# EAGLE schematic prot_2 (EAGLE 6.6.0)

## Sheet 1 of 3
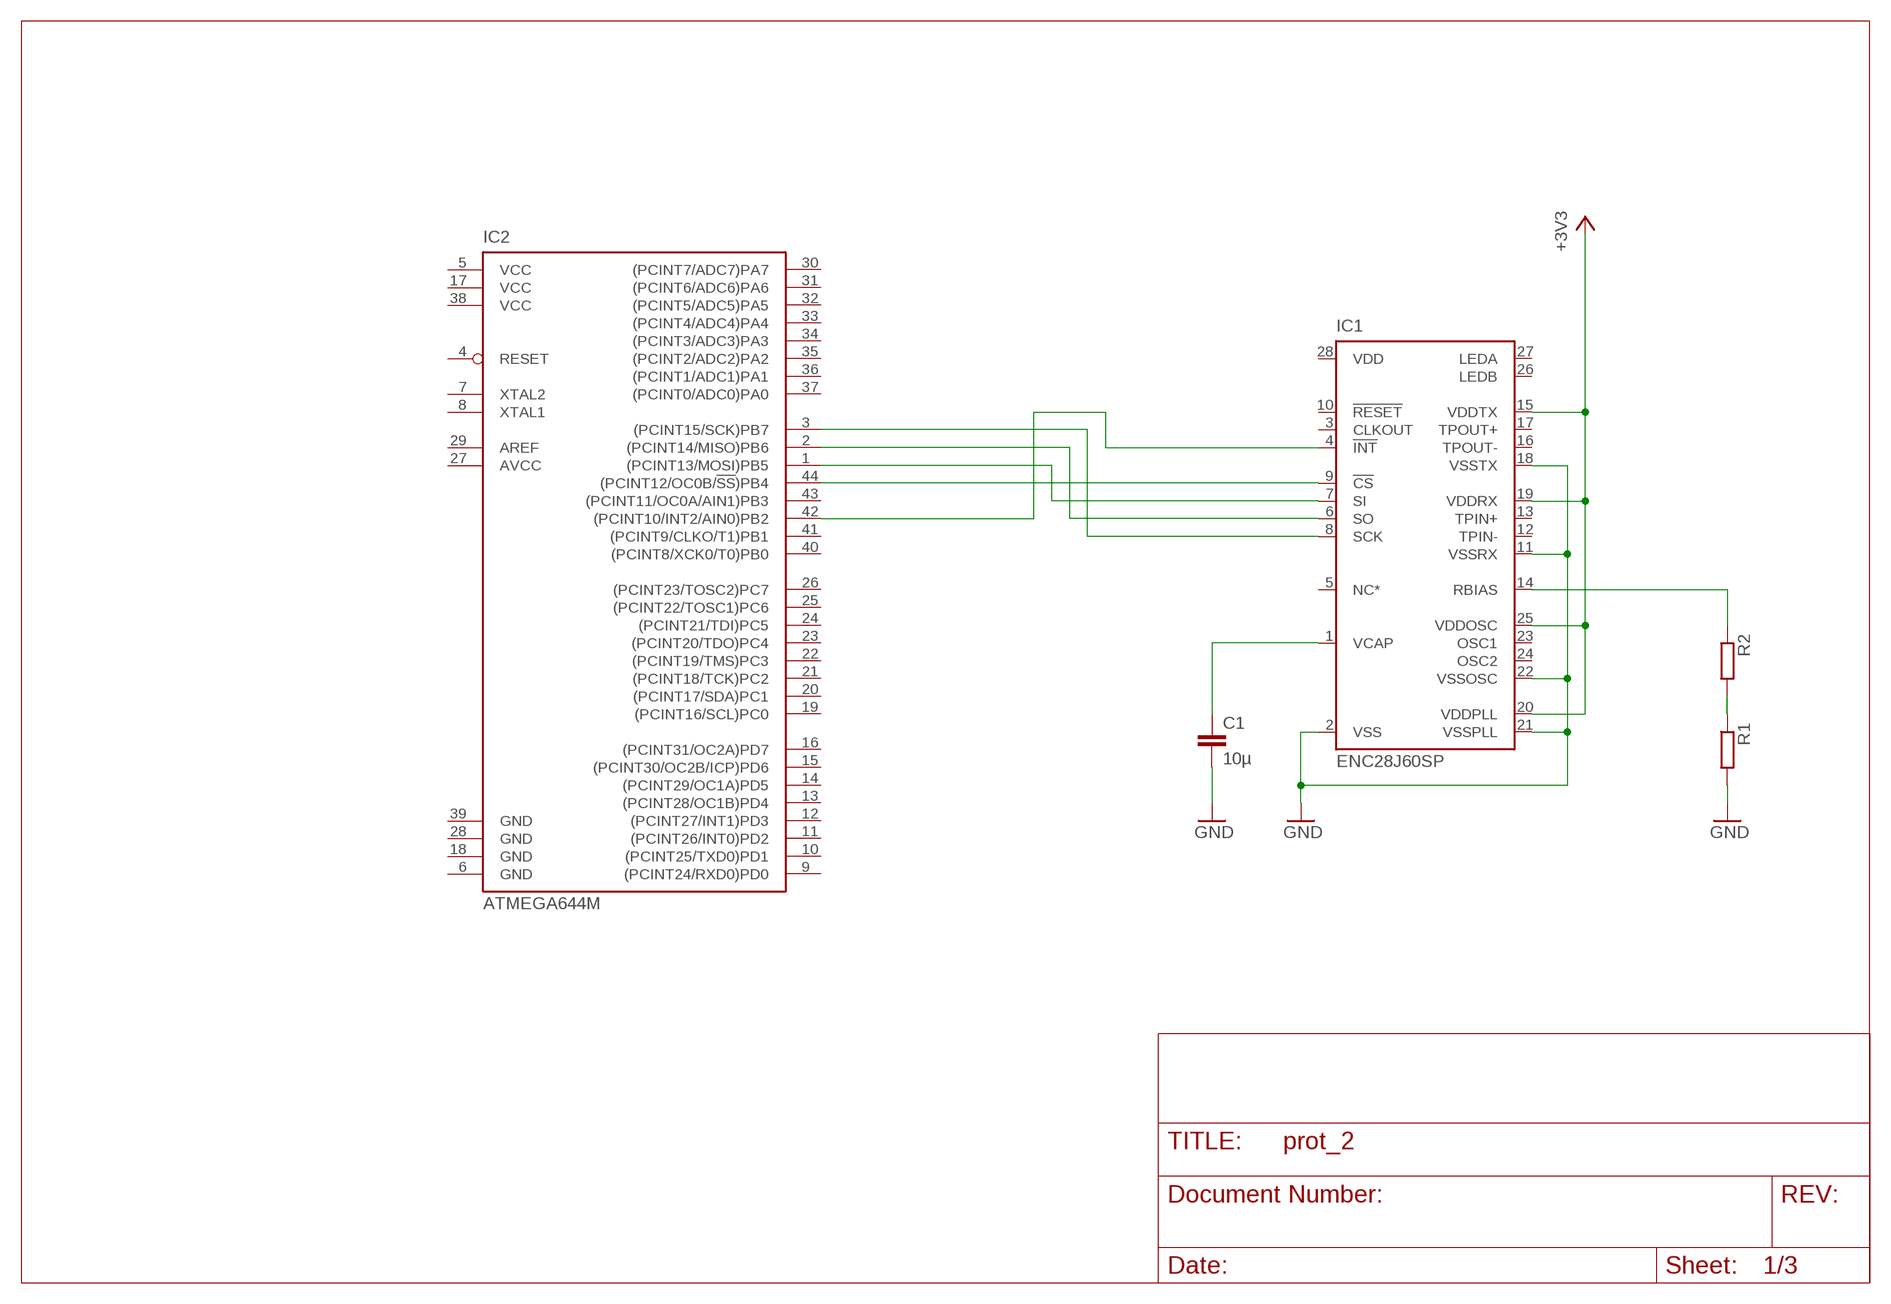
[diagram p0: schematic, sheet 1]

### Parts
C1  10µ  C-EUC1206K  [C1206K]
IC1  ENC28J60SP  [DIL28-3]
IC2  ATMEGA644M  [QFN44ML8X8]
R1  R-EU_R1206  [R1206]
R2  R-EU_R1206  [R1206]

### Nets
+3V3: IC1.15(VDDTX) IC1.19(VDDRX) IC1.20(VDDPLL) IC1.25(VDDOSC) ; also sheet 2,3
GND: C1.2 IC1.2(VSS) IC1.11(VSSRX) IC1.18(VSSTX) IC1.21(VSSPLL) IC1.22(VSSOSC) R1.2 ; also sheet 2,3
N$1: IC1.9(!CS) IC2.44((PCINT12/OC0B/!SS!)PB4)
N$2: IC1.7(SI) IC2.1((PCINT13/MOSI)PB5)
N$3: IC1.6(SO) IC2.2((PCINT14/MISO)PB6)
N$4: IC1.8(SCK) IC2.3((PCINT15/SCK)PB7)
N$5: IC1.4(!INT) IC2.42((PCINT10/INT2/AIN0)PB2)
N$11: C1.1 IC1.1(VCAP)
N$12: R1.1 R2.2
N$13: IC1.14(RBIAS) R2.1
Unconnected: IC1.3(CLKOUT) IC1.5(NC*) IC1.10(!RESET) IC1.12(TPIN-) IC1.13(TPIN+) IC1.16(TPOUT-) IC1.17(TPOUT+) IC1.23(OSC1) IC1.24(OSC2) IC1.26(LEDB) IC1.27(LEDA) IC1.28(VDD) IC2.4(RESET) IC2.7(XTAL2) IC2.8(XTAL1) IC2.9((PCINT24/RXD0)PD0) IC2.10((PCINT25/TXD0)PD1) IC2.11((PCINT26/INT0)PD2) IC2.12((PCINT27/INT1)PD3) IC2.13((PCINT28/OC1B)PD4) IC2.14((PCINT29/OC1A)PD5) IC2.15((PCINT30/OC2B/ICP)PD6) IC2.16((PCINT31/OC2A)PD7) IC2.19((PCINT16/SCL)PC0) IC2.20((PCINT17/SDA)PC1) IC2.21((PCINT18/TCK)PC2) IC2.22((PCINT19/TMS)PC3) IC2.23((PCINT20/TDO)PC4) IC2.24((PCINT21/TDI)PC5) IC2.25((PCINT22/TOSC1)PC6) IC2.26((PCINT23/TOSC2)PC7) IC2.29(AREF) IC2.30((PCINT7/ADC7)PA7) IC2.31((PCINT6/ADC6)PA6) IC2.32((PCINT5/ADC5)PA5) IC2.33((PCINT4/ADC4)PA4) IC2.34((PCINT3/ADC3)PA3) IC2.35((PCINT2/ADC2)PA2) IC2.36((PCINT1/ADC1)PA1) IC2.37((PCINT0/ADC0)PA0) IC2.40((PCINT8/XCK0/T0)PB0) IC2.41((PCINT9/CLKO/T1)PB1) IC2.43((PCINT11/OC0A/AIN1)PB3)

## Sheet 2 of 3
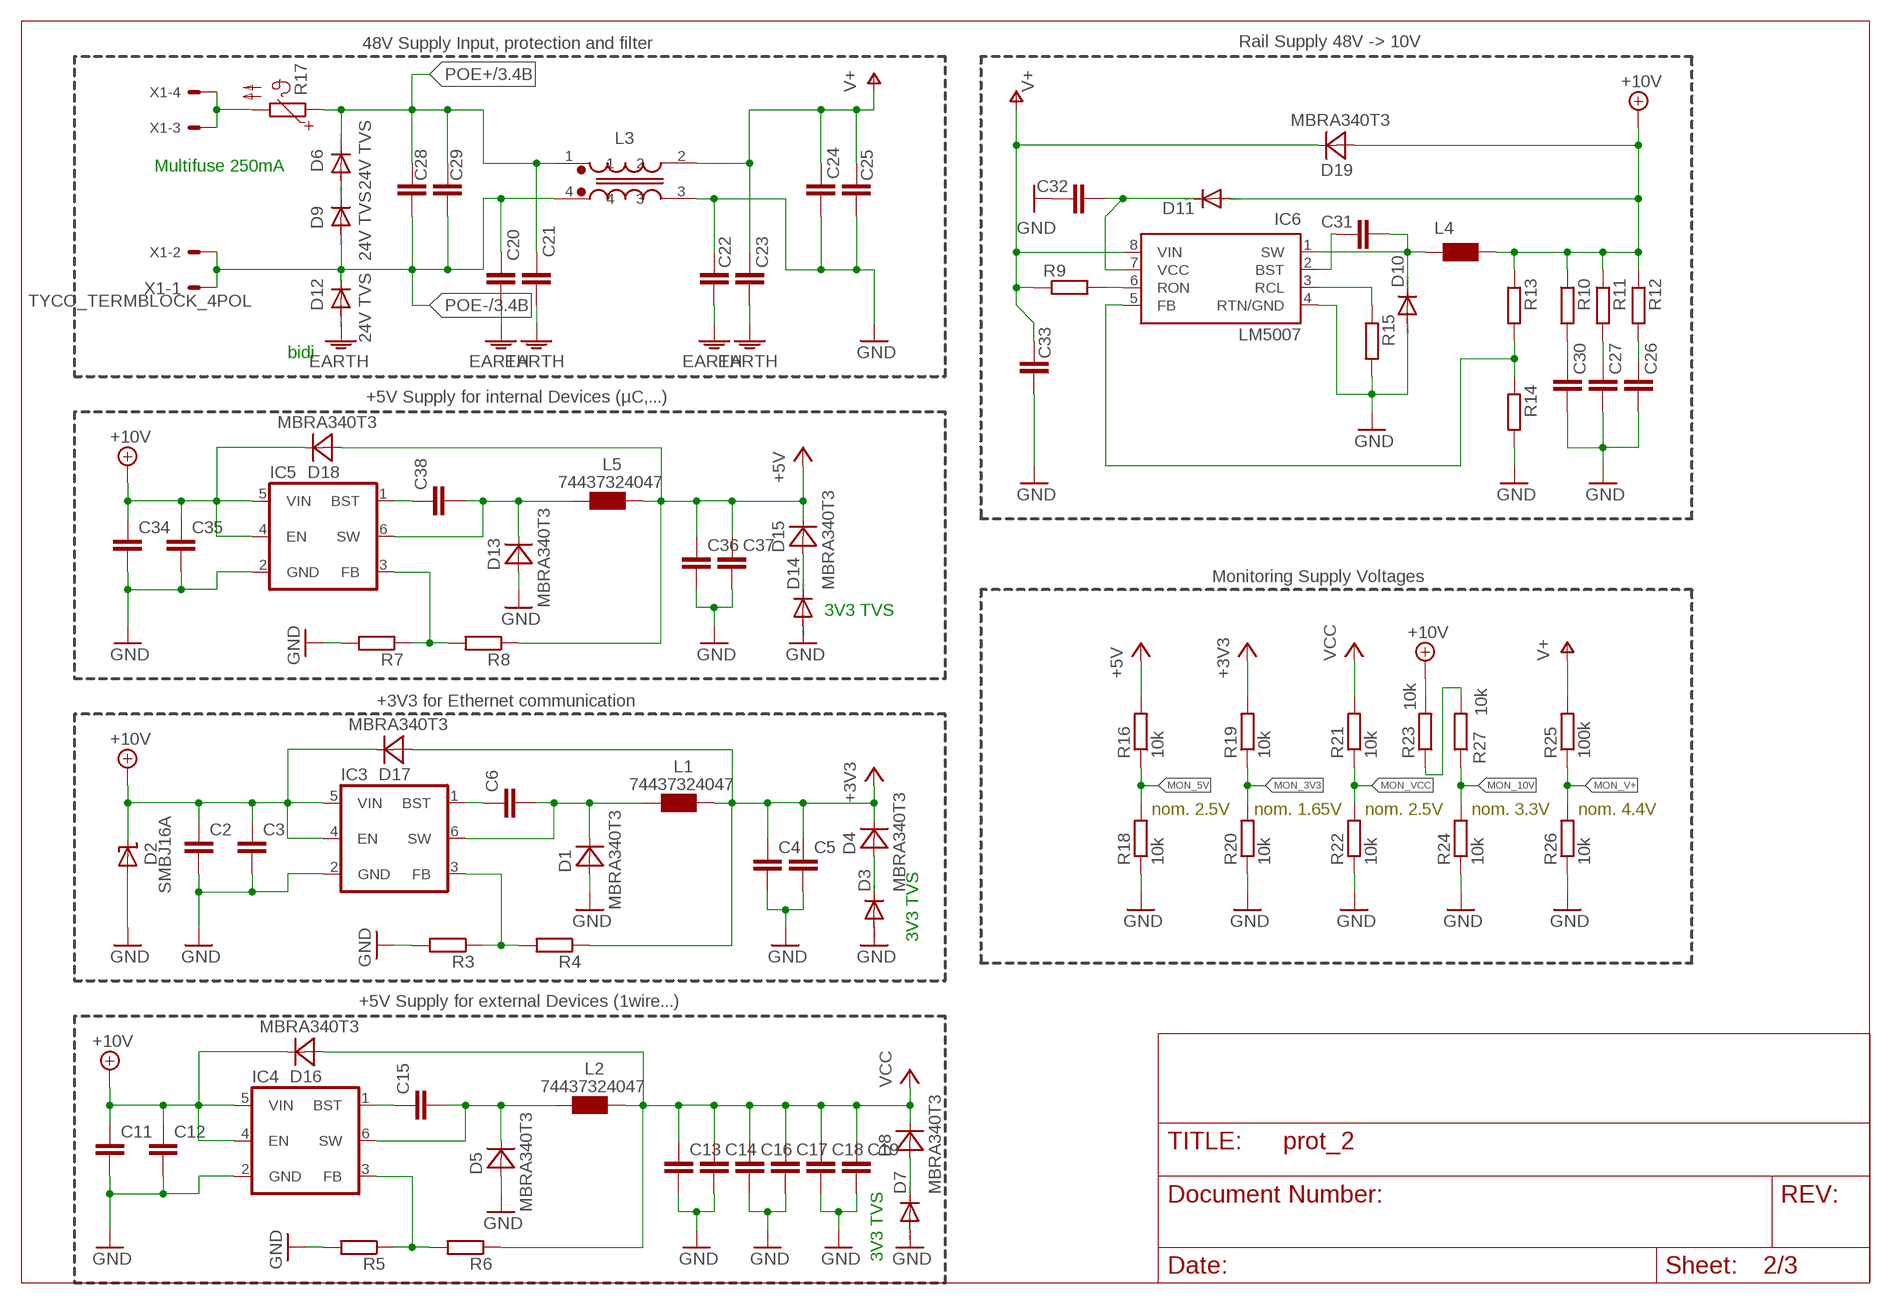
[diagram p1: schematic, sheet 2]

### Parts
C2  C-EUC1206  [C1206]
C3  C-EUC1206  [C1206]
C4  C-EUC1206  [C1206]
C5  C-EUC1206  [C1206]
C6  C-EUC1206  [C1206]
C11  C-EUC1206  [C1206]
C12  C-EUC1206  [C1206]
C13  C-EUC1206  [C1206]
C14  C-EUC1206  [C1206]
C15  C-EUC1206  [C1206]
C16  C-EUC1206  [C1206]
C17  C-EUC1206  [C1206]
C18  C-EUC1206  [C1206]
C19  C-EUC1206  [C1206]
C20  C-EUC1206  [C1206]
C21  C-EUC1206  [C1206]
C22  C-EUC1206  [C1206]
C23  C-EUC1206  [C1206]
C24  C-EUC1206  [C1206]
C25  C-EUC1206  [C1206]
C26  C-EUC1206  [C1206]
C27  C-EUC1206  [C1206]
C28  C-EUC1206  [C1206]
C29  C-EUC1206  [C1206]
C30  C-EUC1206  [C1206]
C31  C-EUC1206  [C1206]
C32  C-EUC1206  [C1206]
C33  C-EUC1206  [C1206]
C34  C-EUC1206  [C1206]
C35  C-EUC1206  [C1206]
C36  C-EUC1206  [C1206]
C37  C-EUC1206  [C1206]
C38  C-EUC1206  [C1206]
D1  MBRA340T3  [SMA]
D2  SMBJ16A  [DO214AA_POL]
D3  DIODE-DO214AA  [DO214AA]
D4  MBRA340T3  [SMA]
D5  MBRA340T3  [SMA]
D6  24V TVS  DIODE-SMC  [SMC]
D7  DIODE-DO214AA  [DO214AA]
D8  MBRA340T3  [SMA]
D9  24V TVS  DIODE-SMC  [SMC]
D10  DIODE-SOD123  [SOD123]
D11  DIODE-SOD123  [SOD123]
D12  24V TVS  DIODE-SMC  [SMC]
D13  MBRA340T3  [SMA]
D14  DIODE-DO214AA  [DO214AA]
D15  MBRA340T3  [SMA]
D16  MBRA340T3  [SMA]
D17  MBRA340T3  [SMA]
D18  MBRA340T3  [SMA]
D19  MBRA340T3  [SMA]
IC3  ADP2301  [TSOT-6]
IC4  ADP2301  [TSOT-6]
IC5  ADP2301  [TSOT-6]
IC6  LM5007  [SOP-08]
L1  74437324047  [WüRTH_4020]
L2  74437324047  [WüRTH_4020]
L3  WE-SL5  [WE-SL5]
L4  SRU1048  [SRU1048]
L5  74437324047  [WüRTH_4020]
R3  R-EU_R0603  [R0603]
R4  R-EU_R0603  [R0603]
R5  R-EU_R0603  [R0603]
R6  R-EU_R0603  [R0603]
R7  R-EU_R0603  [R0603]
R8  R-EU_R0603  [R0603]
R9  R-EU_R0603  [R0603]
R10  R-EU_R0603  [R0603]
R11  R-EU_R0603  [R0603]
R12  R-EU_R0603  [R0603]
R13  R-EU_R0603  [R0603]
R14  R-EU_R0603  [R0603]
R15  R-EU_R0603  [R0603]
R16  10k  R-EU_R0603  [R0603]
R17  B59773  [B773]
R18  10k  R-EU_R0603  [R0603]
R19  10k  R-EU_R0603  [R0603]
R20  10k  R-EU_R0603  [R0603]
R21  10k  R-EU_R0603  [R0603]
R22  10k  R-EU_R0603  [R0603]
R23  10k  R-EU_R0603  [R0603]
R24  10k  R-EU_R0603  [R0603]
R25  100k  R-EU_R0603  [R0603]
R26  10k  R-EU_R0603  [R0603]
R27  10k  R-EU_R0603  [R0603]
X1  TYCO_TERMBLOCK_4POL  [TYPO_TERMBLOCK_4POL]

### Nets
+3V3: C4.1 C5.1 D4.C D17.A L1.P$2 R4.1 R19.2 ; also sheet 1,3
+5V: C36.1 C37.1 D15.C D18.A L5.P$2 R8.1 R16.2
+10V: C2.1 C3.1 C11.1 C12.1 C34.1 C35.1 D2.C D11.A D16.C D17.C D18.C D19.A IC3.4(EN) IC3.5(VIN) IC4.4(EN) IC4.5(VIN) IC5.4(EN) IC5.5(VIN) L4.2 R10.1 R11.1 R12.1 R13.1 R23.2
EARTH: C20.2 C21.2 C22.2 C23.2 D12.A
GND: C2.2 C3.2 C4.2 C5.2 C11.2 C12.2 C13.2 C14.2 C16.2 C17.2 C18.2 C19.2 C22.1 C24.2 C25.2 C26.2 C27.2 C30.2 C32.1 C33.2 C34.2 C35.2 C36.2 C37.2 D1.A D2.A D3.A D5.A D7.A D10.A D13.A D14.A IC3.2(GND) IC4.2(GND) IC5.2(GND) IC6.4(RTN/GND) L3.3 R3.2 R5.2 R7.2 R15.2 R18.1 R20.1 R22.1 R24.1 R26.1 ; also sheet 1,3
MON_3V3: R19.1 R20.2
MON_5V: R16.1 R18.2
MON_10V: R24.2 R27.1
MON_V+: R25.1 R26.2
MON_VCC: R21.1 R22.2
N$6: C6.2 D1.C IC3.6(SW) L1.P$1
N$7: D3.C D4.A
N$8: C6.1 IC3.1(BST)
N$9: D6.A D9.C
N$10: R23.1 R27.2
N$14: C15.2 D5.C IC4.6(SW) L2.P$1
N$15: IC3.3(FB) R3.1 R4.2
N$16: C15.1 IC4.1(BST)
N$17: IC4.3(FB) R5.1 R6.2
N$18: D7.C D8.A
N$19: IC6.3(RCL) R15.1
N$20: C31.2 D10.C IC6.1(SW) L4.1
N$21: C31.1 IC6.2(BST)
N$22: R17.P$2 X1.3 X1.4
N$23: IC6.5(FB) R13.2 R14.1
N$25: C30.1 R10.2
N$26: C27.1 R11.2
N$27: C26.1 R12.2
N$28: C38.2 D13.C IC5.6(SW) L5.P$1
N$30: R14.2 ; supply symbol labelled GND
N$31: IC6.6(RON) R9.2
N$32: C38.1 IC5.1(BST)
N$33: IC5.3(FB) R7.1 R8.2
N$34: D14.C D15.A
N$35: C32.2 D11.C IC6.7(VCC)
POE+: C21.1 C28.1 C29.1 D6.C L3.1 R17.P$1 ; also sheet 3
POE-: C20.1 C28.2 C29.2 D9.A D12.C L3.4 X1.1 X1.2 ; also sheet 3
V+: C23.1 C24.1 C25.1 C33.1 D19.C IC6.8(VIN) L3.2 R9.1 R25.2
VCC: C13.1 C14.1 C16.1 C17.1 C18.1 C19.1 D8.C D16.A L2.P$2 R6.1 R21.2

### Notes on the sheet
- 48V Supply Input, protection and filter | Rail Supply 48V -> 10V
- Multifuse 250mA
- bidi
- +5V Supply for internal Devices (µC,...)
- Monitoring Supply Voltages
- 3V3 TVS
- +3V3 for Ethernet communication
- nom. 2.5V | nom. 1.65V | nom. 2.5V | nom. 3.3V | nom. 4.4V
- 3V3 TVS
- +5V Supply for external Devices (1wire...)
- 3V3 TVS

## Sheet 3 of 3
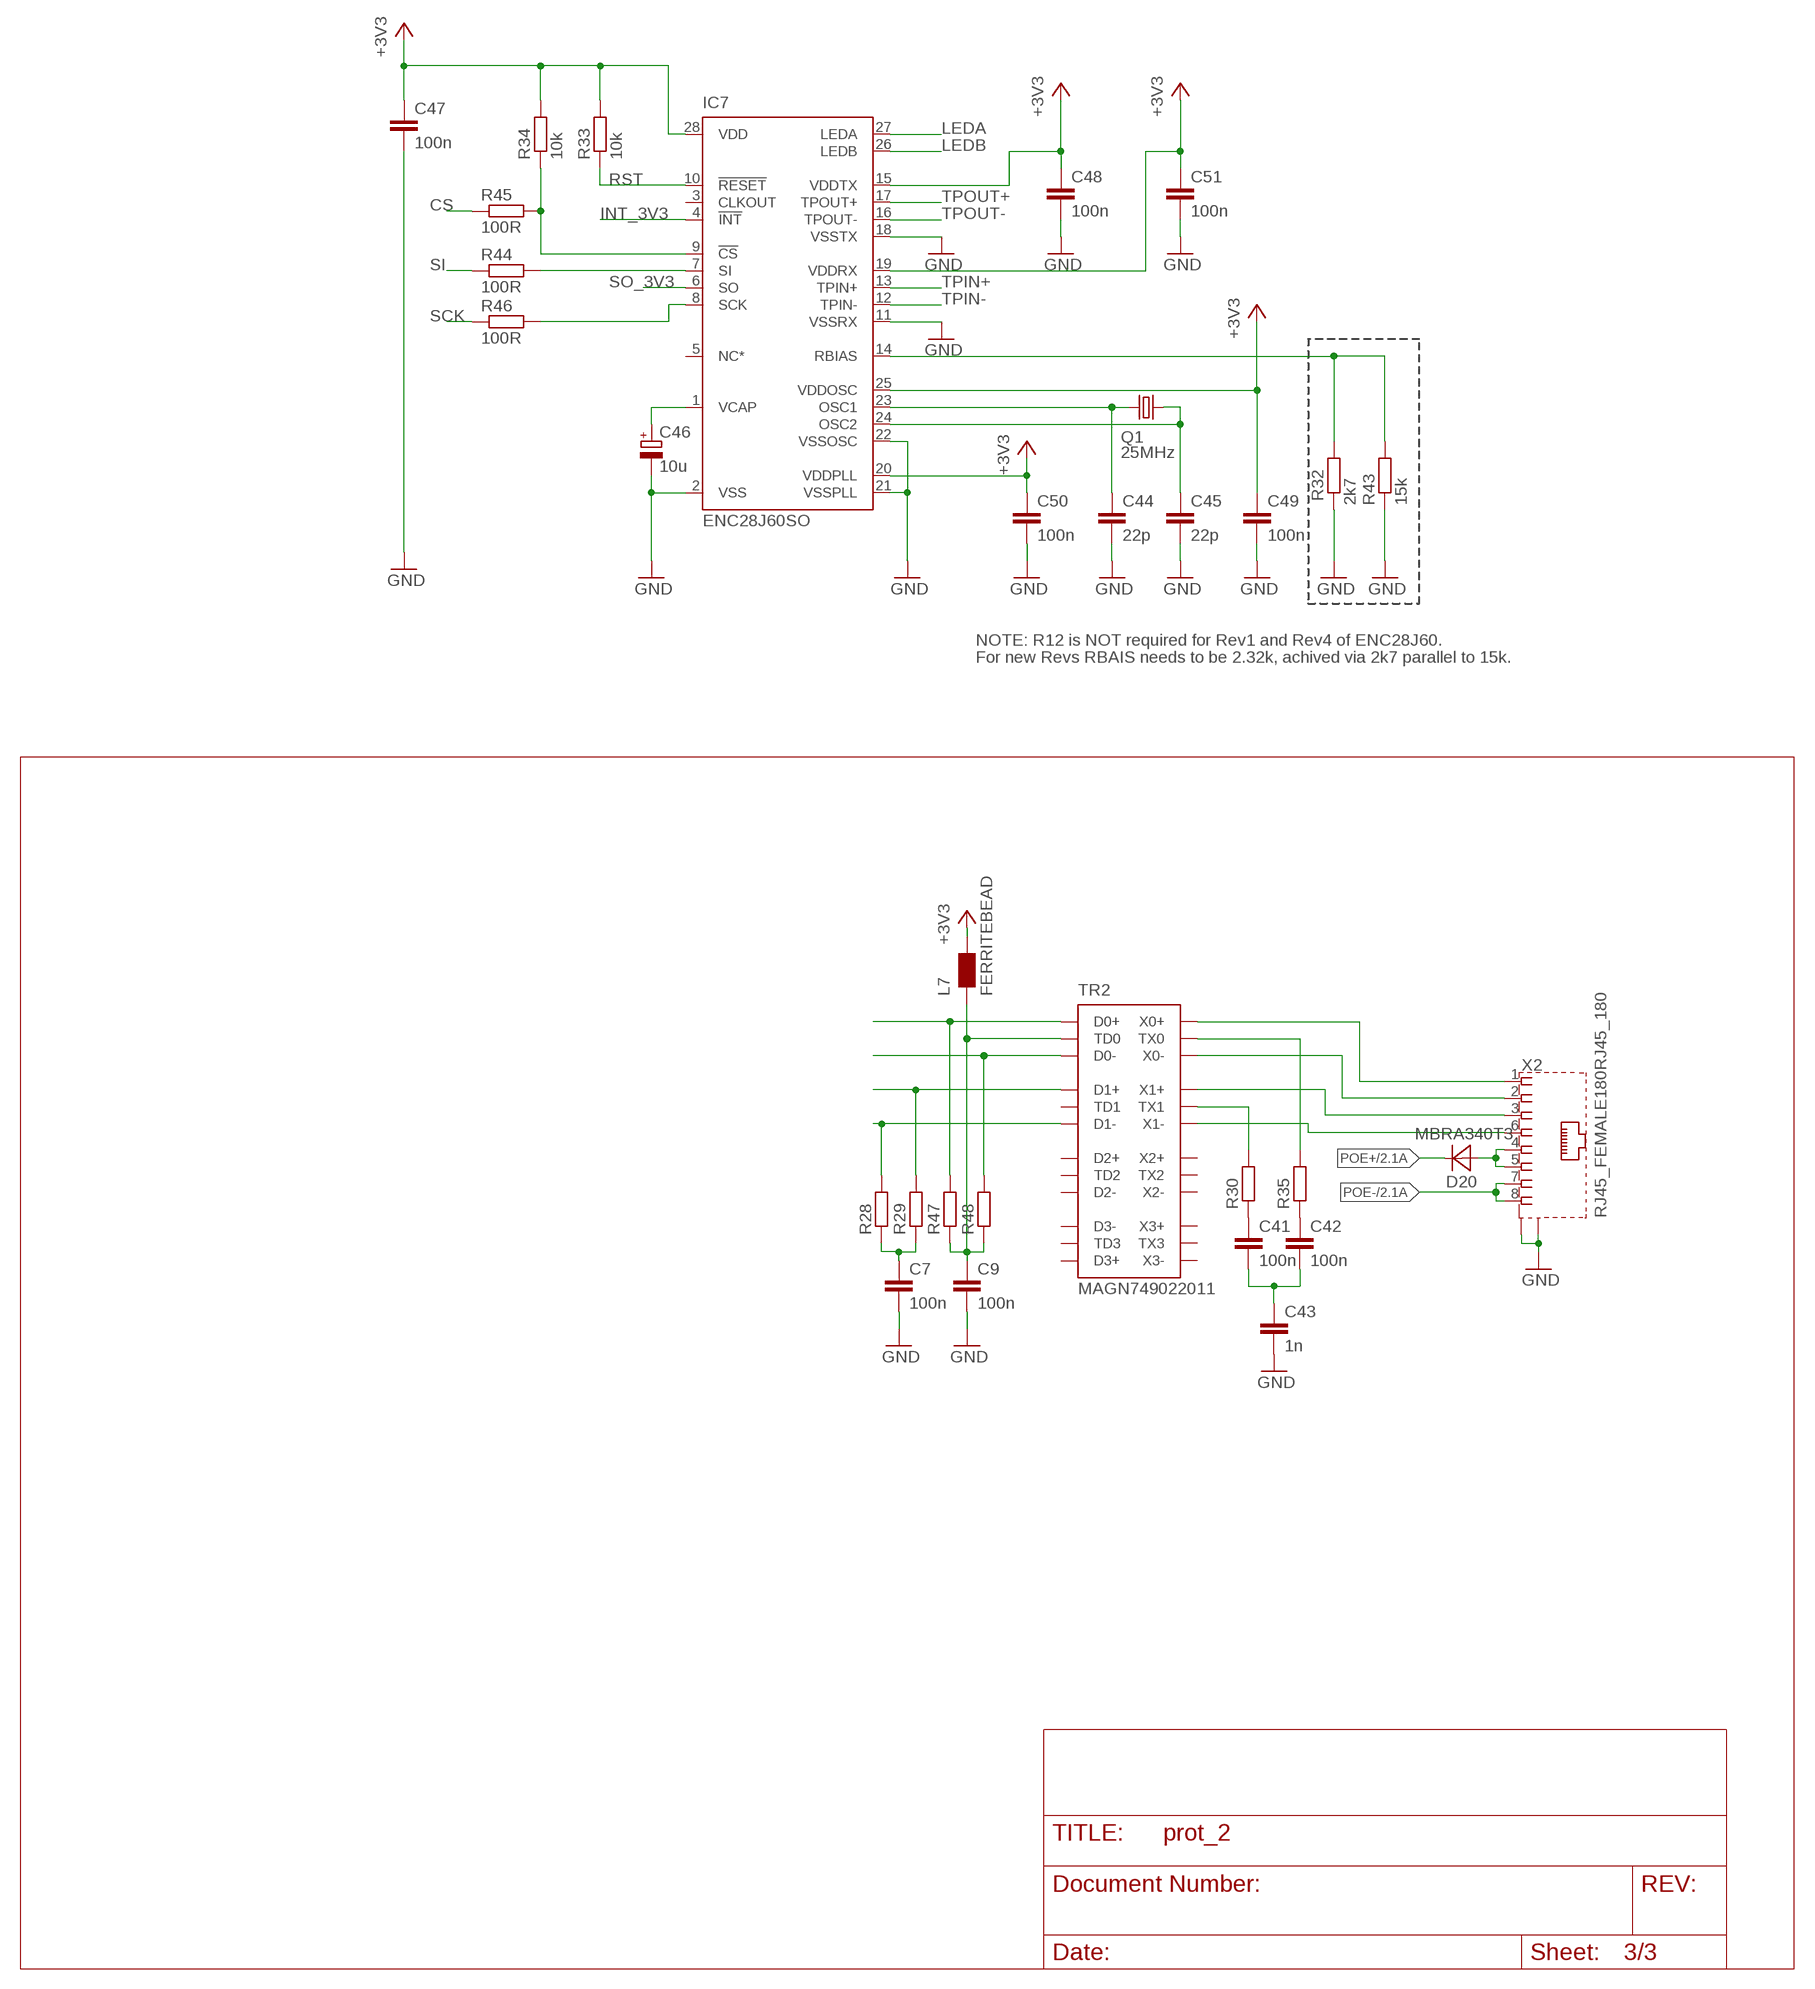
[diagram p2: schematic, sheet 3]

### Parts
C7  100n  C-EUC0603  [C0603]
C9  100n  C-EUC0603  [C0603]
C41  100n  C-EUC0603  [C0603]
C42  100n  C-EUC0603  [C0603]
C43  1n  C-EUC0603  [C0603]
C44  22p  C-EUC1206  [C1206]
C45  22p  C-EUC1206  [C1206]
C46  10u  CPOL-EUE2.5-5  [E2,5-5]
C47  100n  C-EUC1206  [C1206]
C48  100n  C-EUC1206  [C1206]
C49  100n  C-EUC1206  [C1206]
C50  100n  C-EUC1206  [C1206]
C51  100n  C-EUC1206  [C1206]
D20  MBRA340T3  [SMA]
IC7  ENC28J60SO  [SO28W]
L7  FERRITEBEAD  [R0603]
Q1  25MHz  CRYSTALHC49S  [HC49/S]
R28  R-EU_R0603  [R0603]
R29  R-EU_R0603  [R0603]
R30  R-EU_MELF0207W  [MINI_MELF-0207W]
R32  2k7  R-EU_M1206  [M1206]
R33  10k  R-EU_M1206  [M1206]
R34  10k  R-EU_M1206  [M1206]
R35  R-EU_MELF0207W  [MINI_MELF-0207W]
R43  15k  R-EU_M1206  [M1206]
R44  100R  R-EU_M1206  [M1206]
R45  100R  R-EU_M1206  [M1206]
R46  100R  R-EU_M1206  [M1206]
R47  R-EU_R0603  [R0603]
R48  R-EU_R0603  [R0603]
TR2  MAGN749022011  ETH_MAG749022011  [SO24_XL]
X2  RJ45_FEMALE180RJ45_180  [RJ45-SHIELD180]

### Nets
+3V3: C47.1 C48.1 C49.1 C50.1 C51.1 IC7.15(VDDTX) IC7.19(VDDRX) IC7.20(VDDPLL) IC7.25(VDDOSC) IC7.28(VDD) L7.2 R33.2 R34.2 ; also sheet 1,2
CS: R45.2
GND: C7.2 C9.2 C43.2 C44.2 C45.2 C46.- C47.2 C48.2 C49.2 C50.2 C51.2 IC7.2(VSS) IC7.11(VSSRX) IC7.18(VSSTX) IC7.21(VSSPLL) IC7.22(VSSOSC) R32.2 R43.2 X2.S1(S) X2.S2(S) ; also sheet 1,2
INT_3V3: IC7.4(!INT)
LEDA: IC7.27(LEDA)
LEDB: IC7.26(LEDB)
N$24: C44.1 IC7.23(OSC1) Q1.1
N$29: C45.1 IC7.24(OSC2) Q1.2
N$36: C46.+ IC7.1(VCAP)
N$37: IC7.14(RBIAS) R32.1 R43.1
N$38: C41.1 R30.1
N$39: C9.1 L7.1 R47.1 R48.1 TR2.P$1(TD0)
N$40: IC7.7(SI) R44.1
N$41: IC7.9(!CS) R34.1 R45.1
N$42: TR2.P$23(X0+) X2.1
N$43: TR2.P$22(X0-) X2.2
N$44: TR2.P$20(X1+) X2.3
N$45: TR2.P$19(X1-) X2.6
N$46: C41.2 C42.2 C43.1
N$47: R28.2 TR2.P$6(D1-)
N$48: C7.1 R28.1 R29.1
N$49: R29.2 TR2.P$5(D1+)
N$50: R35.2 TR2.P$24(TX0)
N$51: C42.1 R35.1
N$52: D20.A X2.4 X2.5
N$53: R48.2 TR2.P$3(D0-)
N$54: R30.2 TR2.P$21(TX1)
N$55: R47.2 TR2.P$2(D0+)
N$63: IC7.8(SCK) R46.1
POE+: D20.C ; also sheet 2
POE-: X2.7 X2.8 ; also sheet 2
RST: IC7.10(!RESET) R33.1
SCK: R46.2
SI: R44.2
SO_3V3: IC7.6(SO)
TPIN+: IC7.13(TPIN+)
TPIN-: IC7.12(TPIN-)
TPOUT+: IC7.17(TPOUT+)
TPOUT-: IC7.16(TPOUT-)
Unconnected: IC7.3(CLKOUT) IC7.5(NC*) TR2.P$4(TD1) TR2.P$7(TD2) TR2.P$8(D2+) TR2.P$9(D2-) TR2.P$10(TD3) TR2.P$11(D3+) TR2.P$12(D3-) TR2.P$13(X3-) TR2.P$14(X3+) TR2.P$15(TX3) TR2.P$16(X2-) TR2.P$17(X2+) TR2.P$18(TX2)

### Notes on the sheet
- NOTE: R12 is NOT required for Rev1 and Rev4 of ENC28J60.
- For new Revs RBAIS needs to be 2.32k, achived via 2k7 parallel to 15k.

## Power pins joined to a net without a drawn wire
AVCC: IC2.27(AVCC)
GND: IC2.6(GND) IC2.18(GND) IC2.28(GND) IC2.39(GND)
VCC: IC2.5(VCC) IC2.17(VCC) IC2.38(VCC)

## Library data of the parts
C1-C7 C9 C11-C38 C41-C45 C47-C51 = rcl:C-EU: CAPACITOR, European symbol
C46 = rcl:CPOL-EU: POLARIZED CAPACITOR, European symbol
D1 D4 D5 D8 D13 D15-D20 = DTP_Semicond:MBRA340T3: Surface Mount Schottky Power Rectifier Source: http://www.onsemi.com/pub_link/Collateral/MBRA340T3-D.PDF
D2 = DTP_Semicond:SMBJ16A: SMBJ16A TVS Diode Vr-min = 17.8 V, Ppulse = 600 W; PARTNR: E0174300
D3 D6 D7 D9-D12 D14 = diode:DIODE-: DIODE
IC1 = microchip:ENC28J60: Stand-Alone Ethernet Controller with SPI Interface Source: http://ww1.microchip.com/downloads/en/DeviceDoc/39662c.pdf; MF: MICROCHIP; MPN: ENC28J60/SP; OC_FARNELL: 1084619; OC_NEWARK: 96K3661
IC2 = atmel:ATMEGA644: 8-bit Microcontroller with 64K Bytes In-System Programmable Flash Source: http://www.atmel.com/dyn/resources/prod_documents/doc2593.pdf; MPN: ATMEGA644PV-10MU; OC_FARNELL: 1748529; OC_NEWARK: 26R5637
IC3-IC5 = DTP_Supply:ADP2301: ADP2301AUJ SOT23-6 Conv single SMD Vin_min: 3 V Vin_max: 20 V Vref: 0.8 V Iswitch_max: 1.2 A IMS: E0823100 <\\omicron.at\DFS\GLOBAL\OMICRON\Synergies\Innovation\Components\CompIMS\IC/SwitchReg/E0823100_ADP2301/E0823100.html> History Version Date Employee Description 1.0 2014.09.05 ChrJoc00 Added description; PARTNR: E0823100
IC6 = lm5007:LM5007
IC7 = microchip-6:ENC28J60: Stand-Alone Ethernet Controller with SPI Interface Source: http://ww1.microchip.com/downloads/en/DeviceDoc/39662c.pdf
L1 L2 L5 = DTP_Passives:74437324047
L3 = EagleLibrary_Wuerth_Elektronik_eiSos_V6_20140807:WE-SL5: SMD Common Mode Line Filter WE-SL5 - Small size - Low Profile - High Impedance up to 13000 ohm - High Current up to 2500mA -- Data Lines -- Power Lines <http://katalog.we-online.de/media/images/eisos/IndSL5_pf2.jpg> Details see: http://katalog.we-online.de/en/pbs/WE-SL5? Updated by Dan Xu 2014-07-11 2014 (C) Würth Elektronik
L4 = DTP_Passives:SRU1048; PARTNR: E0700500
L7 = DTP_Passives:FERRITEBEAD
Q1 = crystal:CRYSTAL: CRYSTAL
R1-R16 R18-R30 R32-R35 R43-R48 = rcl:R-EU_: RESISTOR, European symbol
R17 = DTP_Passives:B59773: PHILIPS PTC; PARTNR: E0140700
TR2 = DTP_Passives:ETH_MAG749022011
X1 = DTP_Connectors:TYCO_TERMBLOCK_4POL
X2 = DTP_Connectors:RJ45_FEMALE180: RJ45 Low Profile Shield Type 2 For all RJ45 L, LC, LCT and X Series Models Source: www.tycoelectronics.com .. ENG_DS_1654001_1099_RJ_L_0507.pdf; PARTNR: E0823500